# EAGLE design template (EAGLE 7.4.0)
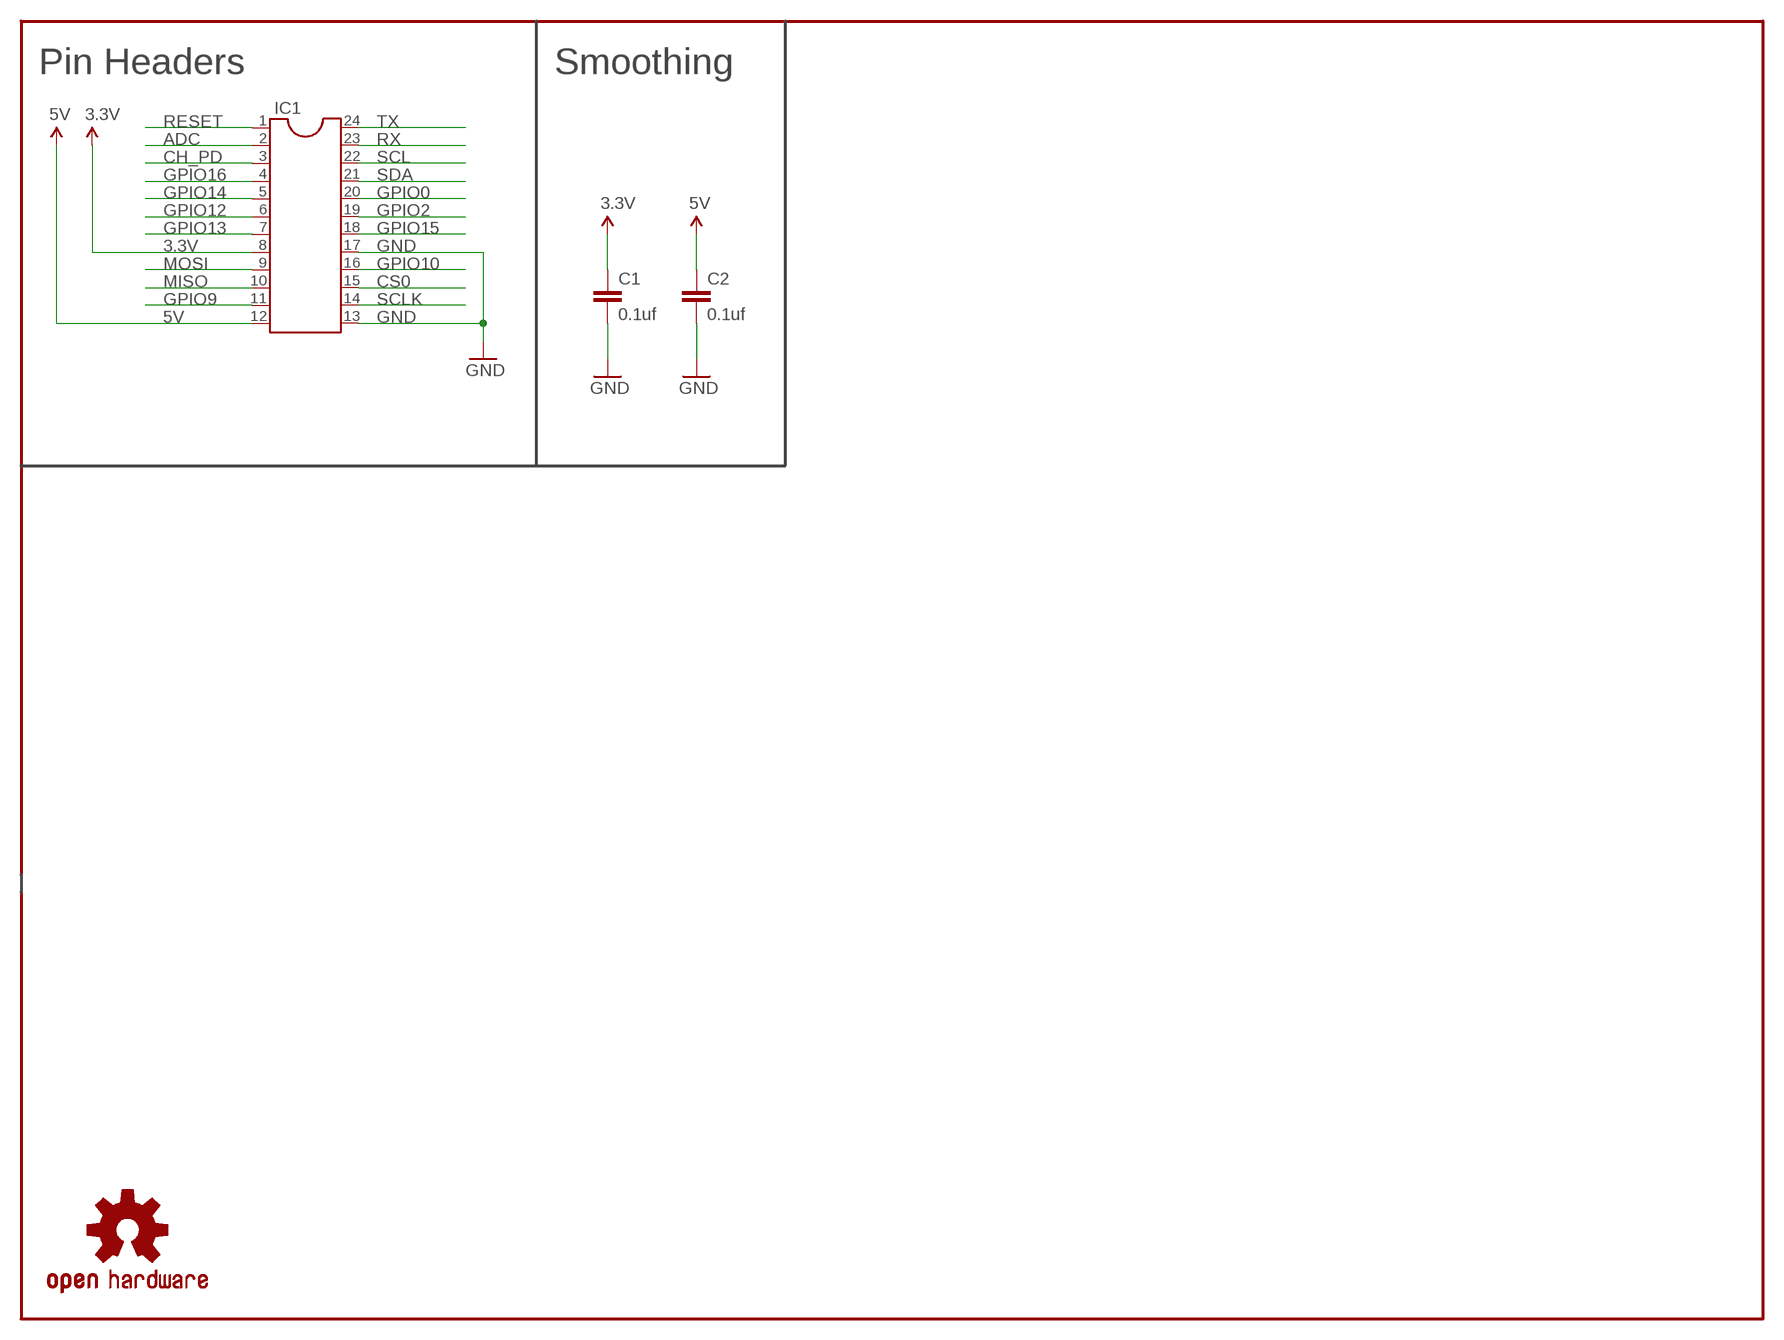
[diagram p0: schematic, sheet 1]

## Parts
C1  0.1uf  CAP1206  [1206]
C2  0.1uf  CAP1206  [1206]
FRAME1  FRAME-LETTERNO_PACKAGE  [DUMMY]
IC1  DIL24-9  [DIL24-9]
LOGO1  OSHW-LOGOS  [OSHW-LOGO-S]

## Nets
3.3V: C1.1 IC1.8
5V: C2.1 IC1.12
ADC: IC1.2
CH_PD: IC1.3
CS0: IC1.15
GND: C1.2 C2.2 IC1.13 IC1.17
GPIO0: IC1.20
GPIO2: IC1.19
GPIO9: IC1.11
GPIO10: IC1.16
GPIO12: IC1.6
GPIO13: IC1.7
GPIO14: IC1.5
GPIO15: IC1.18
GPIO16: IC1.4
MISO: IC1.10
MOSI: IC1.9
RESET: IC1.1
RX: IC1.23
SCL: IC1.22
SCLK: IC1.14
SDA: IC1.21
TX: IC1.24

## Notes on the sheet
- Pin Headers | Smoothing

## Library data of the parts
C1 C2 = SparkFun-Capacitors:CAP: Capacitor Standard 0603 ceramic capacitor, and 0.1" leaded capacitor.
FRAME1 = SparkFun-Aesthetics:FRAME-LETTER: Schematic Frame Standard 8.5x11 US Letter frame; DESIGNER: Nobody; VERSION: v01
IC1 = ic-package:DIL24: Dual In Line
LOGO1 = SparkFun-Aesthetics:OSHW-LOGO: Open Source Hardware Logo This logo indicates the piece of hardware it is found on incorporates a OSHW license and/or adheres to the definition of open source hardware found here: http://freedomdefined.org/OSHW

## Net classes
1 power: width 0.254 mm

## Board
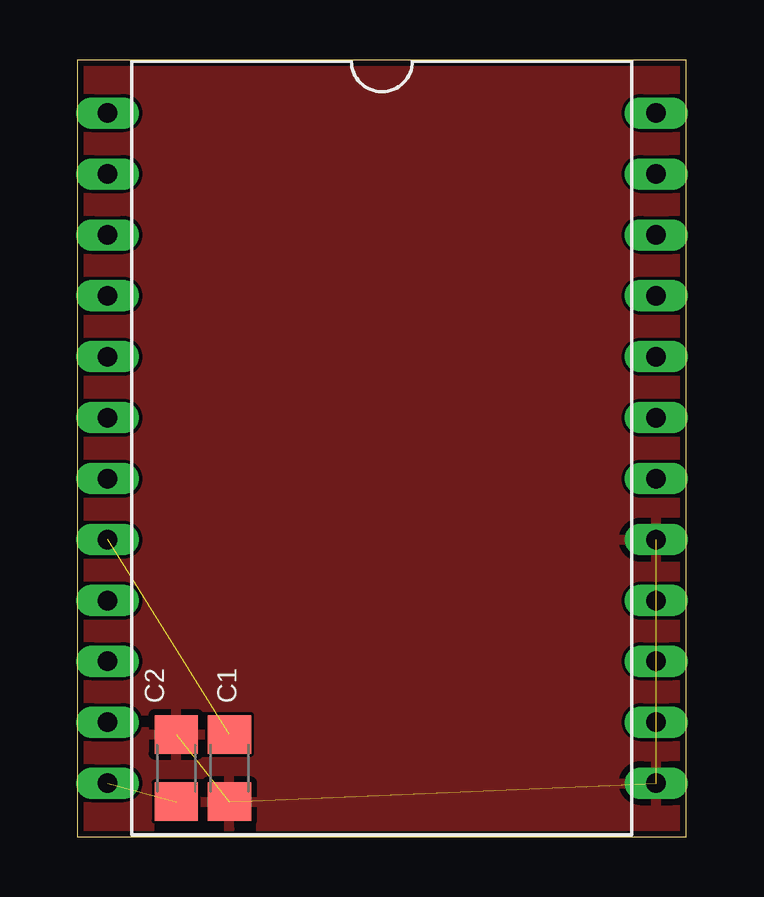
[diagram p1: board, top side]
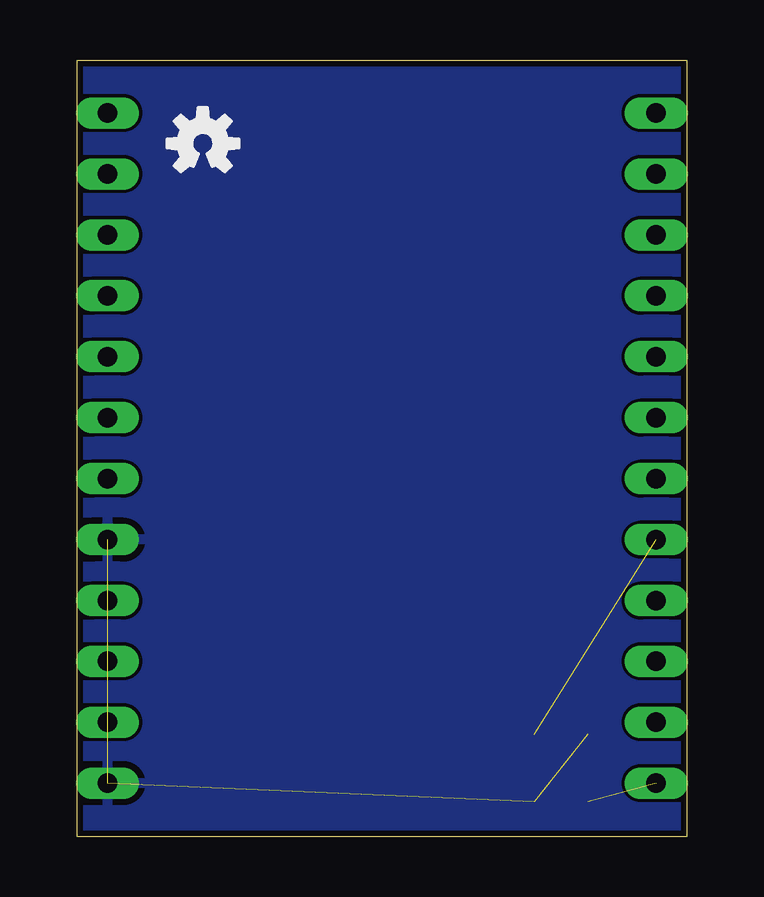
[diagram p2: board, bottom side, seen from below]

Size 25.39 x 32.38 mm. Coordinates in mm from the lower left corner, seen from the top.
Outline: 0,0 25.39,0 25.39,32.38 0,32.38 0,0
Copper layers (1*16): Top 0.035mm / dielectric 1.5mm / Bottom 0.035mm
Design rules "dirtypcbs": minimum track width 5mil, minimum drill 12mil, track to track 5mil, track to pad 5mil, pad to pad 5mil, via to via 5mil, smd to smd 0mil, copper to edge 10mil, drill to drill 10mil, minimum pad ring 10mil, minimum via ring 6mil, stop-mask expansion 2mil, vias tented up to drill 25mil, thermal gap 10mil

### Footprints (pad centres in the part's own frame; a part is rotated, then mirrored left to right if it is on the bottom)
1206 = smd 1.6 x 1.8: 1 -1.4,0; 2 1.4,0
DIL24-9 = drill 0.813 long: 1 -13.97,-11.43; 2 -11.43,-11.43; 3 -8.89,-11.43; 4 -6.35,-11.43; 5 -3.81,-11.43; 6 -1.27,-11.43; 7 1.27,-11.43; 8 3.81,-11.43; 9 6.35,-11.43; 10 8.89,-11.43; 11 11.43,-11.43; 12 13.97,-11.43; 13 13.97,11.43; 14 11.43,11.43; 15 8.89,11.43; 16 6.35,11.43; 17 3.81,11.43; 18 1.27,11.43; 19 -1.27,11.43; 20 -3.81,11.43; 21 -6.35,11.43; 22 -8.89,11.43; 23 -11.43,11.43; 24 -13.97,11.43

### Placement (x,y rotation side)
C1  6.35,2.86 270 top
C2  4.13,2.86 90 top
FRAME1  0.32,-4.29 0 top  (outside the outline)
IC1  12.7,16.19 270 top
LOGO1  20.16,28.89 0 bottom

### Tracks (layer width: path | path; a pad name or v marks a point on that pad's centre or on a via)
3.3V  (1 unrouted)
5V  (1 unrouted)
GND  (3 unrouted)
  pour Bottom: 0,0 25.4,0 25.4,32.38 0,32.38
  pour Top: 0,0 25.4,0 25.4,32.38 0,32.38